# EAGLE design MicroLab (EAGLE 8.7.1)
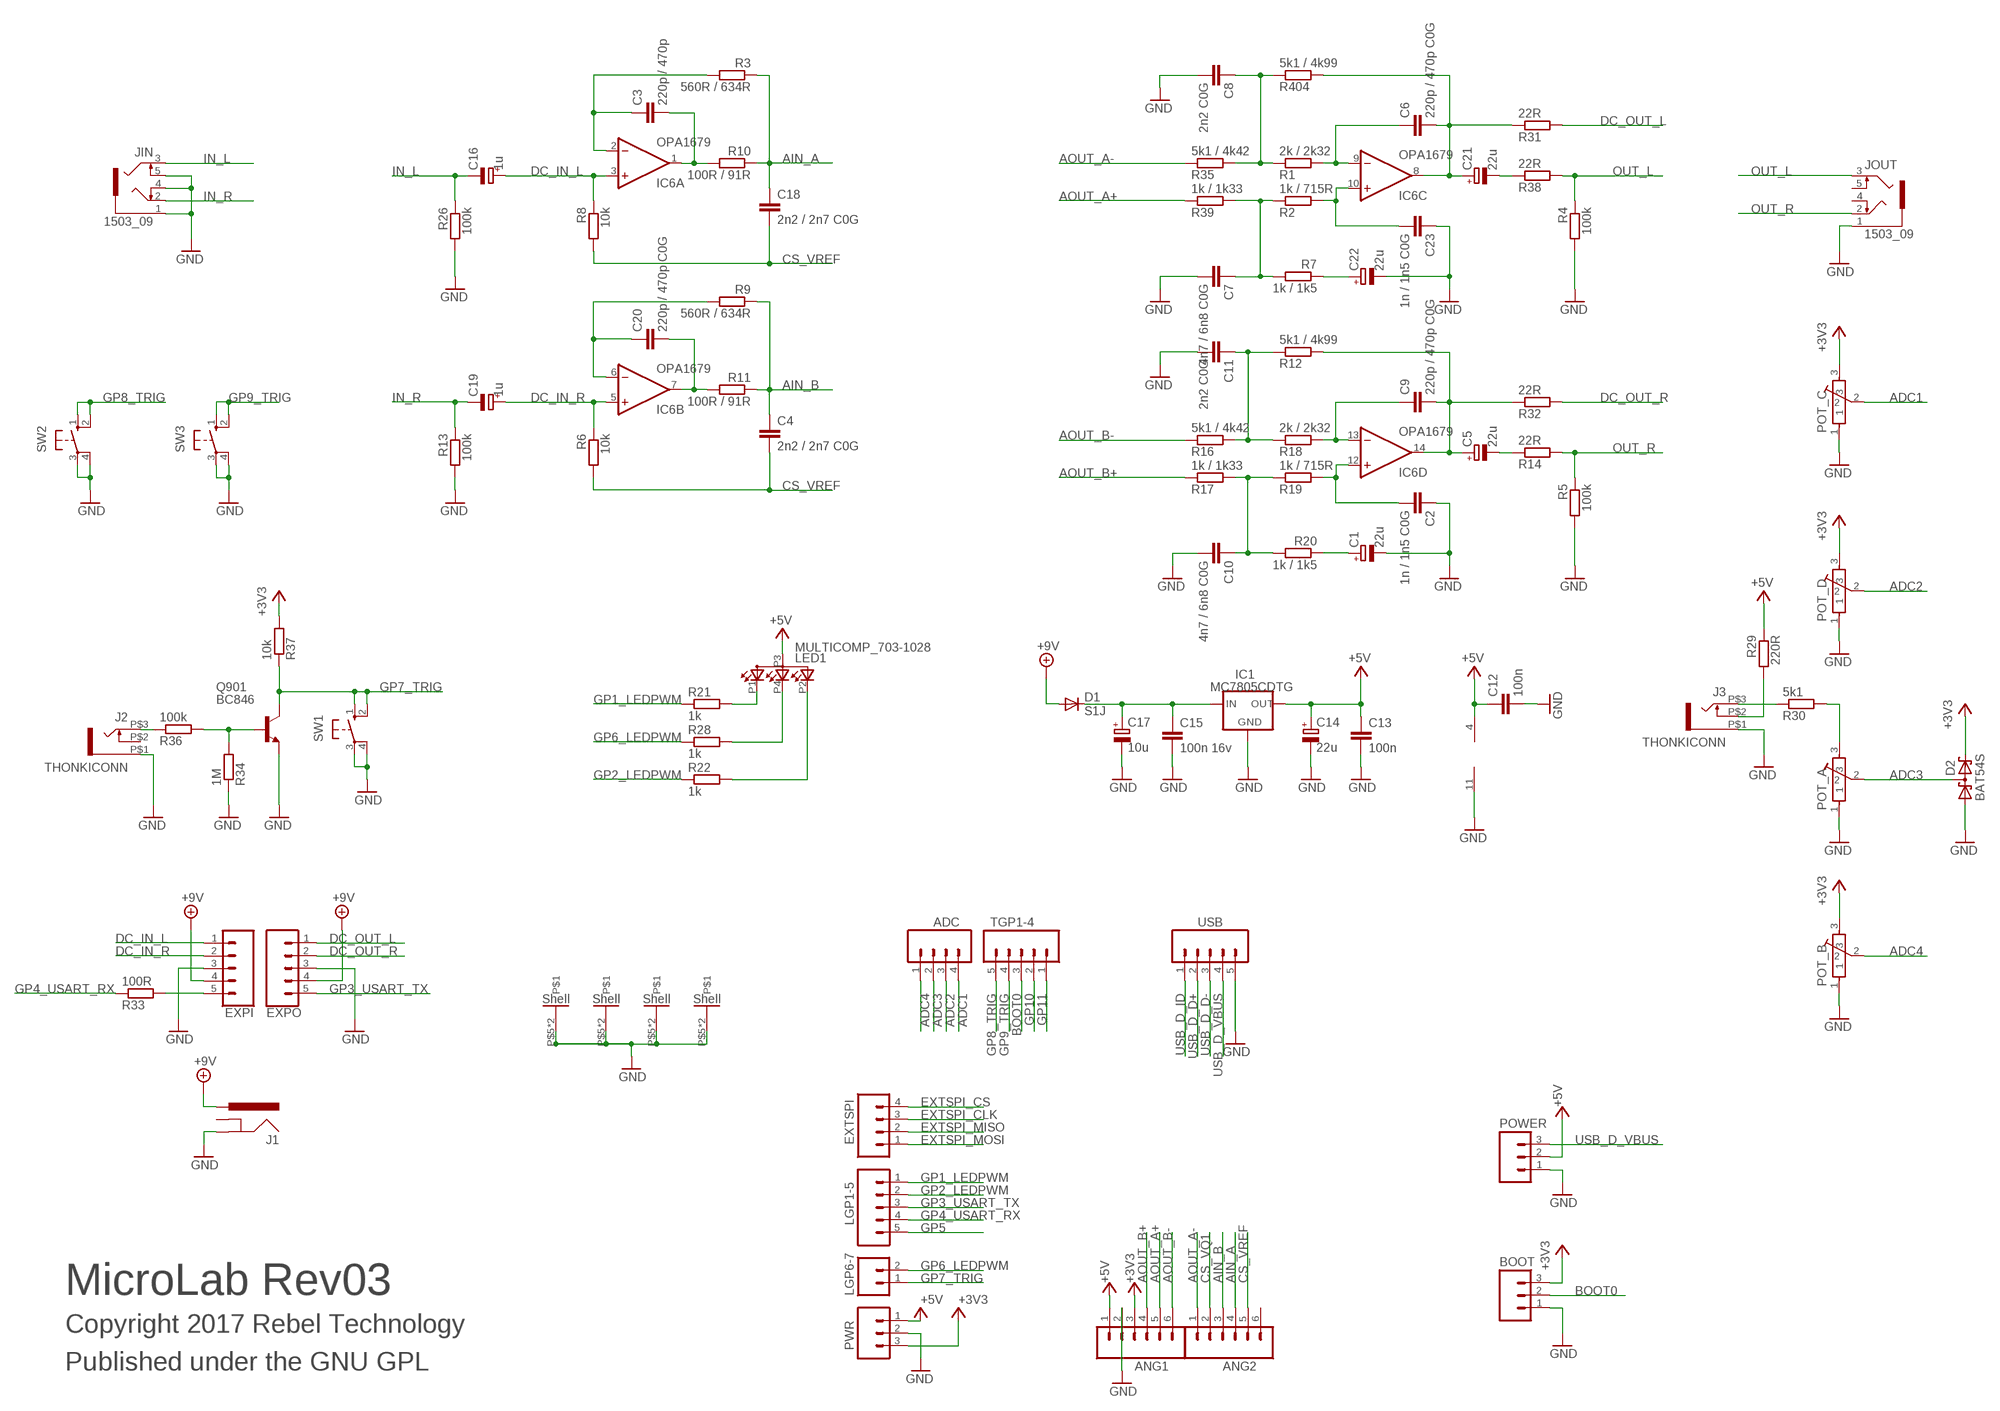
[diagram p0: schematic, sheet 1]

## Parts
ADC  M04PTH  [1X04]
ANG1  M06SIP  [1X06]
ANG2  M06SIP  [1X06]
BOOT  M03PTH  [1X03]
C1  22u  CPOL-EU153CLV-0505  [CPOL-5]
C2  1n / 1n5 C0G  C-EUC0603  [C0603]
C3  220p / 470p  C-EUC0603  [C0603]
C4  2n2 / 2n7 C0G  C-EUC0603  [C0603]
C5  22u  CPOL-EU153CLV-0505  [CPOL-5]
C6  220p / 470p C0G  C-EUC0603  [C0603]
C7  4n7 / 6n8 C0G  C-EUC0603  [C0603]
C8  2n2 C0G  C-EUC0603  [C0603]
C9  220p / 470p C0G  C-EUC0603  [C0603]
C10  4n7 / 6n8 C0G  C-EUC0603  [C0603]
C11  2n2 C0G  C-EUC0603  [C0603]
C12  100n  C-EUC0603  [C0603]
C13  100n  C-EUC0603  [C0603]
C14  22u  CPOL-EU153CLV-0505  [CPOL-5]
C15  100n 16v  C-EUC0603  [C0603]
C16  1u  CPOL-EU153CLV-0405  [153CLV-0405]
C17  10u  CPOL-EU153CLV-0405  [153CLV-0405]
C18  2n2 / 2n7 C0G  C-EUC0603  [C0603]
C19  1u  CPOL-EU153CLV-0405  [153CLV-0405]
C20  220p / 470p C0G  C-EUC0603  [C0603]
C21  22u  CPOL-EU153CLV-0505  [CPOL-5]
C22  22u  CPOL-EU153CLV-0505  [CPOL-5]
C23  1n / 1n5 C0G  C-EUC0603  [C0603]
D1  S1J  DIODESMA  [SMA-DIODE]
D2  BAT54S  [SOT23]
EXPI  CONN_05JST-VERT  [JST-5-PTH-VERT]
EXPO  CONN_05JST-VERT  [JST-5-PTH-VERT]
EXTSPI  M04PTH  [1X04]
IC1  MC7805CDTG  MC78XX  [DPACK]
IC6  OPA1679  LM324D  [SO14]
J1  POWER_JACKPTH  [POWER_JACK_PTH]
J2  THONKICONN  [THONKICONN]
J3  THONKICONN  [THONKICONN]
JIN  1503_09  [1503_09]
JOUT  1503_09  [1503_09]
LED1  MULTICOMP_703-1028  [RGB-LED-703-1028]
LGP1-5  M05PTH  [1X05]
LGP6-7  M02PTH  [1X02]
POT_A  POT-ALPS-RK09L1140  [POT-ALPS-RK09L1140]
POT_B  POT-ALPS-RK09L1140  [POT-ALPS-RK09L1140]
POT_C  POT-ALPS-RK09L1140  [POT-ALPS-RK09L1140]
POT_D  POT-ALPS-RK09L1140  [POT-ALPS-RK09L1140]
POWER  M03PTH  [1X03]
PWR  M03PTH  [1X03]
Q901  BC846  [SOT23]
R1  2k / 2k32  R-EU_0603  [0603]
R2  1k / 715R  R-EU_0603  [0603]
R3  560R / 634R  R-EU_0603  [0603]
R4  100k  R-EU_0603  [0603]
R5  100k  R-EU_0603  [0603]
R6  10k  R-EU_0603  [0603]
R7  1k / 1k5  R-EU_0603  [0603]
R8  10k  R-EU_0603  [0603]
R9  560R / 634R  R-EU_0603  [0603]
R10  100R / 91R  R-EU_0603  [0603]
R11  100R / 91R  R-EU_0603  [0603]
R12  5k1 / 4k99  R-EU_0603  [0603]
R13  100k  R-EU_0603  [0603]
R14  22R  R-EU_0603  [0603]
R16  5k1 / 4k42  R-EU_0603  [0603]
R17  1k / 1k33  R-EU_0603  [0603]
R18  2k / 2k32  R-EU_0603  [0603]
R19  1k / 715R  R-EU_0603  [0603]
R20  1k / 1k5  R-EU_0603  [0603]
R21  1k  R-EU_0603  [0603]
R22  1k  R-EU_0603  [0603]
R26  100k  R-EU_0603  [0603]
R28  1k  R-EU_0603  [0603]
R29  220R  R-EU_0603  [0603]
R30  5k1  R-EU_0603  [0603]
R31  22R  R-EU_0603  [0603]
R32  22R  R-EU_0603  [0603]
R33  100R  R-EU_0603  [0603]
R34  1M  R-EU_0603  [0603]
R35  5k1 / 4k42  R-EU_0603  [0603]
R36  100k  R-EU_0603  [0603]
R37  10k  R-EU_0603  [0603]
R38  22R  R-EU_0603  [0603]
R39  1k / 1k33  R-EU_0603  [0603]
R404  5k1 / 4k99  R-EU_0603  [0603]
SW1  10-XX  [B3F-10XX]
SW2  10-XX  [B3F-10XX]
SW3  10-XX  [B3F-10XX]
TGP1-4  M05PTH  [1X05]
USB  M05PTH  [1X05]

## Nets
+3V3: ANG1.3 BOOT.3 D2.2(C2) POT_B.3 POT_C.3 POT_D.3 PWR.3 R37.2
+5V: ANG1.1 C12.1 C13.1 C14.+ IC1.3(OUT) IC6.4(P:V+) LED1.P3(A) POWER.2 PWR.1 R29.1
+9V: D1.A EXPI.4 EXPO.4 J1.PWR
ADC1: ADC.4 POT_C.2
ADC2: ADC.3 POT_D.2
ADC3: ADC.2 D2.3(C1A2) POT_A.2
ADC4: ADC.1 POT_B.2
AIN_A: ANG2.4 C18.1 R3.1 R10.1
AIN_B: ANG2.3 C4.1 R9.1 R11.1
AOUT_A+: ANG1.5 R39.1
AOUT_A-: ANG2.1 R35.1
AOUT_B+: ANG1.4 R17.1
AOUT_B-: ANG1.6 R16.1
BOOT0: BOOT.2 TGP1-4.3
CS_VQ1: ANG2.2
CS_VREF: ANG2.5 C4.2 C18.2 R6.2 R8.2
DC_IN_L: C16.+ EXPI.1 IC6.3(A:+IN) R8.1
DC_IN_R: C19.+ EXPI.2 IC6.5(B:+IN) R6.1
DC_OUT_L: EXPO.1 R31.2
DC_OUT_R: EXPO.2 R32.2
EXTSPI_CLK: EXTSPI.3
EXTSPI_CS: EXTSPI.4
EXTSPI_MISO: EXTSPI.2
EXTSPI_MOSI: EXTSPI.1
GND: ANG1.2 BOOT.1 C1.- C2.1 C7.2 C8.2 C10.2 C11.2 C12.2 C13.2 C14.- C15.2 C17.- C22.- C23.1 D2.1(A1) EXPI.3 EXPO.3 IC1.4(GND) IC6.11(P:V-) J1.GND J2.P$1 J3.P$1 JIN.1 JIN.4 JIN.5 JOUT.1 POT_A.1 POT_A.P$5 POT_A.P$6 POT_B.1 POT_B.P$5 POT_B.P$6 POT_C.1 POT_C.P$5 POT_C.P$6 POT_D.1 POT_D.P$5 POT_D.P$6 POWER.1 PWR.2 Q901.2(E) R4.2 R5.2 R13.2 R26.2 R34.1 SW1.3(P) SW1.4(P1) SW2.3(P) SW2.4(P1) SW3.3(P) SW3.4(P1) USB.5
GP1_LEDPWM: LGP1-5.1 R21.1
GP2_LEDPWM: LGP1-5.2 R22.1
GP3_USART_TX: EXPO.5 LGP1-5.3
GP4_USART_RX: LGP1-5.4 R33.1
GP5: LGP1-5.5
GP6_LEDPWM: LGP6-7.2 R28.1
GP7_TRIG: LGP6-7.1 Q901.3(C) R37.1 SW1.1(S) SW1.2(S1)
GP8_TRIG: SW2.1(S) SW2.2(S1) TGP1-4.5
GP9_TRIG: SW3.1(S) SW3.2(S1) TGP1-4.4
GP10: TGP1-4.2
GP11: TGP1-4.1
IN_L: C16.- JIN.3 R26.1
IN_R: C19.- JIN.2 R13.1
N$1: EXPI.5 R33.2
N$3: C3.1 IC6.2(A:-IN) R3.2
N$4: C20.2 IC6.7(B:OUT) R11.2
N$5: C20.1 IC6.6(B:-IN) R9.2
N$6: C3.2 IC6.1(A:OUT) R10.2
N$7: C6.1 IC6.9(C:-IN) R1.2
N$8: C1.+ R20.1
N$9: C21.- R38.1
N$10: C22.+ R7.1
N$11: C23.2 IC6.10(C:+IN) R2.2
N$12: C5.+ C9.2 IC6.14(D:OUT) R12.2 R32.1
N$13: C5.- R14.1
N$15: C7.1 R2.1 R7.2 R39.2
N$16: LED1.P1(CRED) R21.2
N$17: LED1.P2(CGREEN) R22.2
N$19: LED1.P4(CBLUE) R28.2
N$22: J2.P$3 R36.1
N$23: J3.P$2 R29.2
N$24: C11.1 R12.1 R16.2 R18.1
N$25: POT_A.3 R30.2
N$26: C9.1 IC6.13(D:-IN) R18.2
N$27: J3.P$3 R30.1
N$29: C15.1 C17.+ D1.C IC1.1(IN)
N$30: C2.2 IC6.12(D:+IN) R19.2
N$32: C10.1 R17.2 R19.1 R20.2
N$37: Q901.1(B) R34.2 R36.2
N$39: C6.2 C21.+ IC6.8(C:OUT) R31.1 R404.2
N$41: C8.1 R1.1 R35.2 R404.1
OUT_L: JOUT.3 R4.1 R38.2
OUT_R: JOUT.2 R5.1 R14.2
USB_D_D+: USB.2
USB_D_D-: USB.3
USB_D_ID: USB.1
USB_D_VBUS: POWER.3 USB.4
Unconnected: ANG2.6 J1.GNDBREAK J2.P$2 JOUT.4 JOUT.5

## Notes on the sheet
- MicroLab Rev03
- Copyright 2017 Rebel Technology
- Published under the GNU GPL

## Library data of the parts
ADC EXTSPI = SparkFun:M04: Header 4 Standard 4-pin 0.1" header. Use with straight break away headers (SKU : PRT-00116), right angle break away headers (PRT-00553), swiss pins (PRT-00743), machine pins (PRT-00117), and female headers (PRT-00115). Molex polarized connector foot print use with SKU : PRT-08231 with associated crimp pins and housings. 1MM SMD Version SKU: PRT-10208
ANG1 ANG2 = SparkFun:M06: Header 6 Standard 6-pin 0.1" header. Use with straight break away headers (SKU : PRT-00116), right angle break away headers (PRT-00553), swiss pins (PRT-00743), machine pins (PRT-00117), and female headers (PRT-00115). Molex polarized connector foot print use with SKU : PRT-08094 with associated crimp pins and housings. NOTES ON THE VARIANTS LOCK and LOCK_LONGPADS... This footprint was designed to help hold the alignment of a through-hole component (i.e. 6-pin header) while soldering it into place. You may notice that each hole has been shifted either up or down by 0.005 of an inch from it's more standard position (which is a perfectly straight line). This slight alteration caused the pins (the squares in the middle) to touch the edges of the holes. Because they are alternating, it causes a "brace" to hold the component in place. 0.005 has proven to be the perfect amount of "off-center" position when using our standard breakaway headers. Although looks a little odd when you look at the bare footprint, once you have a header in there, the alteration is very hard to notice. Also, if you push a header all the way into place, it is covered up entirely on the bottom side. This idea of altering the position of holes to aid alignment will be further integrated into the Sparkfun Library for other footprints. It can help hold any component with 3 or more connection pins.
BOOT POWER PWR = SparkFun:M03: Header 3 Standard 3-pin 0.1" header. Use with straight break away headers (SKU : PRT-00116), right angle break away headers (PRT-00553), swiss pins (PRT-00743), machine pins (PRT-00117), and female headers (PRT-00115). Molex polarized connector foot print use with SKU : PRT-08232 with associated crimp pins and housings.
C1 C5 C14 C16 C17 C19 C21 C22 = Rebel:CPOL-EU: POLARIZED CAPACITOR, European symbol
C2-C4 C6-C12 C18 C20 C23 = resistor:C-EU: CAPACITOR, European symbol
C13 C15 = Rebel:C-EU: CAPACITOR, European symbol
D1 = SparkFun:DIODE: Diode These are standard reverse protection diodes and small signal diodes. SMA package can handle up to about 1A. SOD-323 can handle about 200mA. What the SOD-323 package when ordering, there are some mfgs out there that are 5-pin packages.
D2 = diode:BAT54S: Schottky Diodes Pin connection corrected 2011-05-04 Source: Fairchild .. BAT54.pdf
EXPI EXPO = SparkFun-Connectors:CONN_05: Multi connection point. Often used as Generic Header-pin footprint for 0.1 inch spaced/style header connections On any of the 0.1 inch spaced packages, you can populate with these: Break Away Headers - Straight <https://www.sparkfun.com/products/116> (PRT-00116) Break Away Male Headers - Right Angle <https://www.sparkfun.com/products/553> (PRT-00553) Female Headers <https://www.sparkfun.com/products/115> (PRT-00115) Break Away Headers - Machine Pin <https://www.sparkfun.com/products/117> (PRT-00117) Break Away Female Headers - Swiss Machine Pin <https://www.sparkfun.com/products/743> (PRT-00743) For SCREWTERMINALS and SPRING TERMINALS visit here: Screw Terimnals on SparkFun.com <https://www.sparkfun.com/search/results?term=Screw+Terminals> (5mm/3.5mm/2.54mm spacing) This device is also useful as a general connection point to wire up your design to another part of your project. Our various solder wires solder well into these plated through hole pads. Hook-Up Wire - Assortment (Stranded, 22 AWG) <https://www.sparkfun.com/products/11375> (PRT-11375) Hook-Up Wire - Assortment (Solid Core, 22 AWG) <https://www.sparkfun.com/products/11367> (PRT-11367) View the entire wire category on our website here <https://www.sparkfun.com/categories/141> Special notes: Molex polarized connector foot print use with SKU : PRT-08231 with associated crimp pins and housings. 1MM SMD Version SKU: PRT-10208
IC1 = James:MC78XX: VOLTAGE REGULATOR; OC_FARNELL: 2296028
IC6 = linear:LM324: OP AMP
J1 = SparkFun:POWER_JACK: Power Jack This is the standard 5.5mm barrel jack for power. The PTH is the most common, proven, reliable, footprint. All others are experimental. The Slot footprint only works if the mill layer is transmitted to the PCB fab house so be warned. Spark Fun Electronics SKU : PRT-00119. Mating wall wart : TOL-00298 (and others)
J2 J3 = Rebel:THONKICONN
JIN JOUT = con-lumberg:1503_09: Jack connectors according to JISC 6560, 3.5 mm Klinkeneinbaukupplung nach JISC 6560, 3,5 mm, 3-polig/ stereo, abgewinkelte Ausführung, mit 2 Öffnern und Lötaugen, für Leiterplatten Rückseitenmontage Source: http://www.lumberg.com/Produkte/PDFs/1503_09.pdf; OC_FARNELL: 1243244; OC_NEWARK: unknown
LED1 = Rebel:MULTICOMP_703-1028: Farnell: 2112143
LGP1-5 TGP1-4 USB = SparkFun:M05: Header 5 Standard 5-pin 0.1" header. Use with straight break away headers (SKU : PRT-00116), right angle break away headers (PRT-00553), swiss pins (PRT-00743), machine pins (PRT-00117), and female headers (PRT-00115). Molex polarized connector foot print use with SKU : PRT-08230 with associated crimp pins and housings.
LGP6-7 = SparkFun:M02: Header 2 Standard 2-pin 0.1" header. Use with straight break away headers (SKU : PRT-00116), right angle break away headers (PRT-00553), swiss pins (PRT-00743), machine pins (PRT-00117), and female headers (PRT-00115). Molex polarized connector foot print use with SKU : PRT-08233 with associated crimp pins and housings.
POT_A POT_B POT_C POT_D = Rebel:POT-ALPS-RK09L
Q901 = transistor:BC846: NPN TRANSISTOR
R1-R14 R16-R22 R26 R28-R39 R404 = Rebel:R-EU_: RESISTOR, European symbol
SW1-SW3 = switch-omron:10-XX: OMRON SWITCH; MPN: B3F-1000; OC_FARNELL: 176432; OC_NEWARK: 36M3542

## Net classes
1 power: width 0.178 mm, drill 0.305 mm, clearance 0.178 mm to class 0, clearance 0.178 mm

## Board
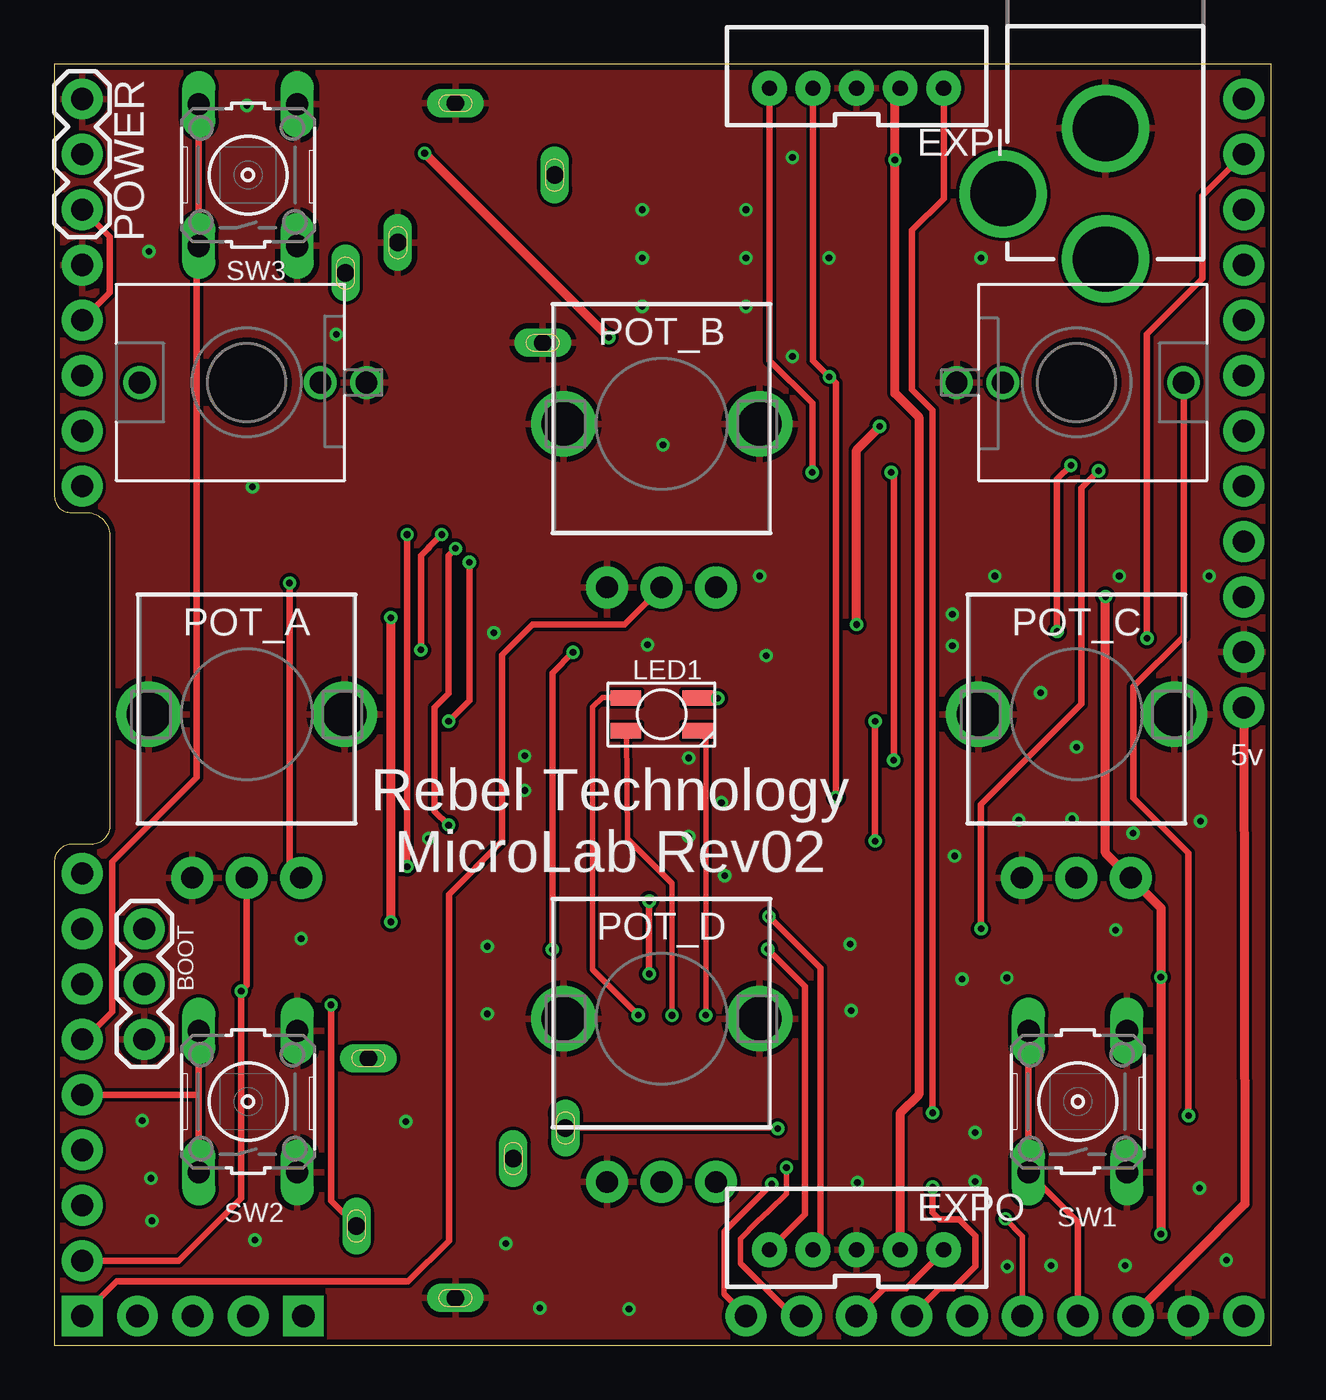
[diagram p1: board, top side]
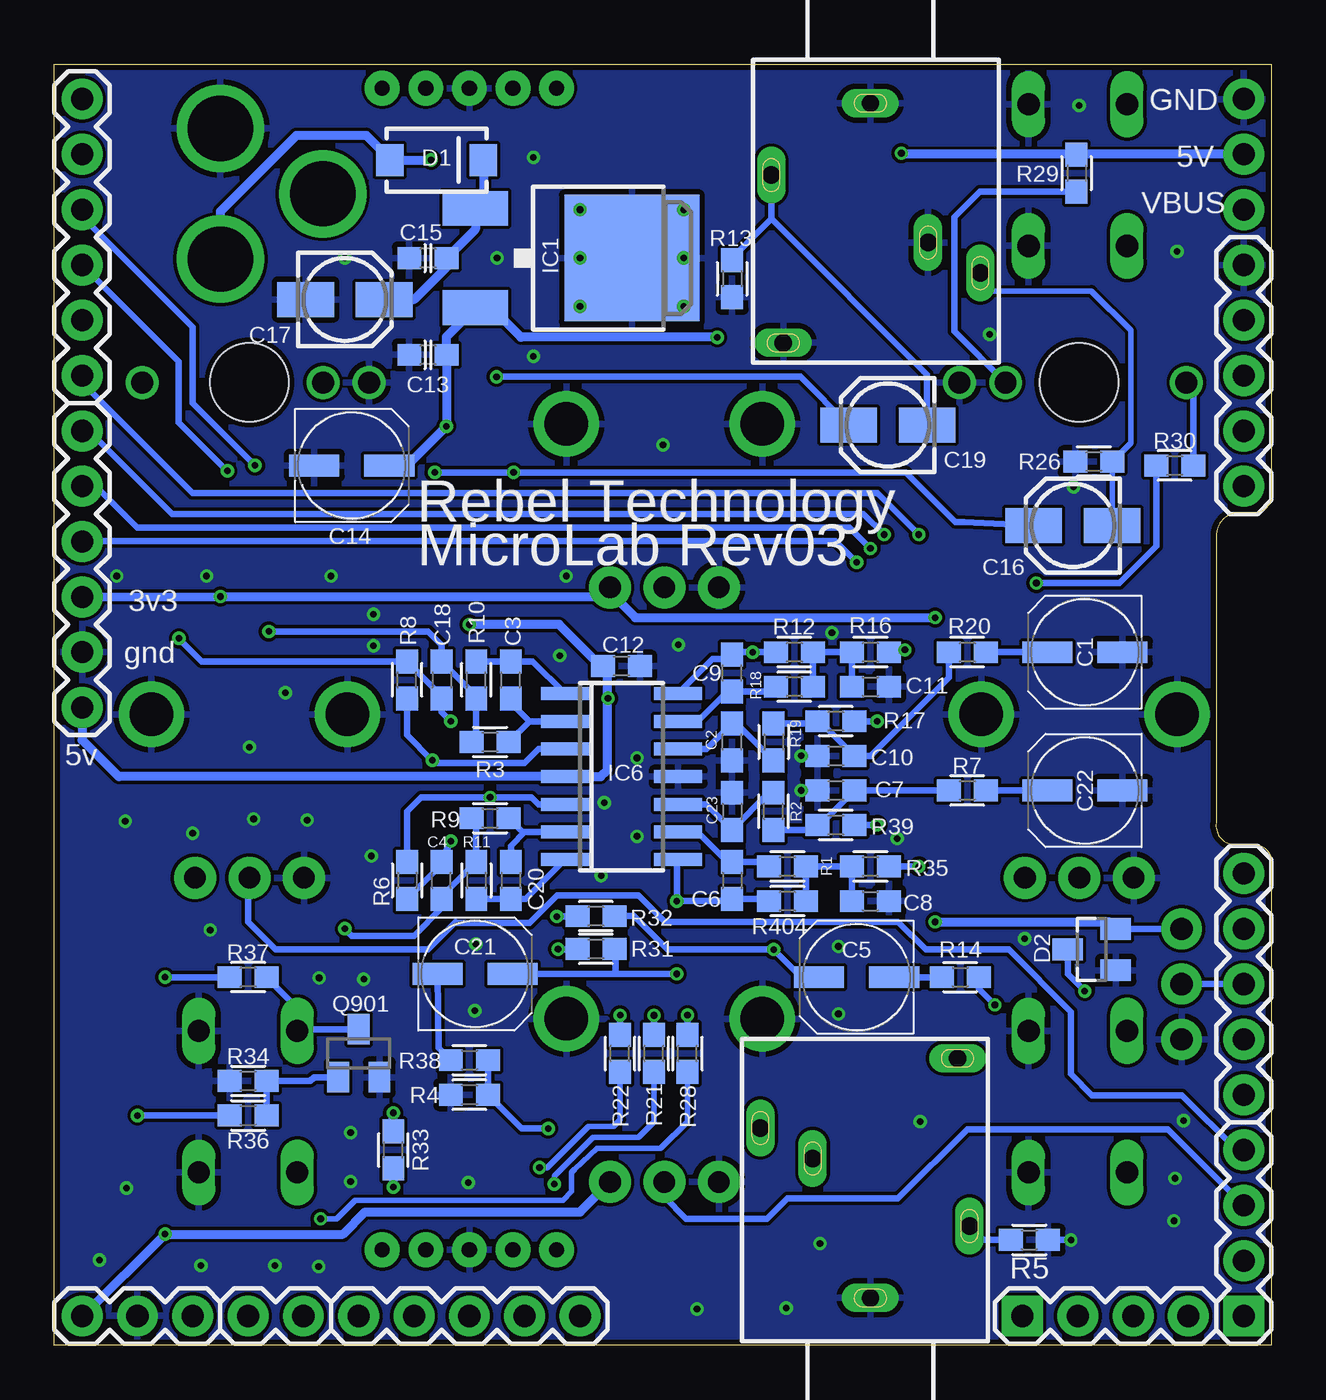
[diagram p2: board, bottom side, seen from below]

Size 55.88 x 58.8 mm. Coordinates in mm from the lower left corner, seen from the top.
Outline: 55.88,58.8 0,58.8 0,38.97 arc90 0.76,38.23 1.52,38.23 arc-90 2.54,37.06 2.54,23.97 arc-90 1.78,22.99 0.76,22.99 arc90 0,22.16 0,0 55.88,0 55.88,58.8
Copper layers (1*16): Top 0.035mm / dielectric 1.5mm / Bottom 0.035mm
Design rules "SeeedStudio_2layer_DRU_no_angle_20140221": minimum track width 6mil, minimum drill 12mil, track to track 6mil, track to pad 6mil, pad to pad 6mil, via to via 6mil, smd to smd 0mil, copper to edge 10mil, drill to drill 10mil, minimum pad ring 10mil, minimum via ring 6mil, stop-mask expansion 2mil, vias tented up to drill 100mil, thermal gap 10mil

### Footprints (pad centres in the part's own frame; a part is rotated, then mirrored left to right if it is on the bottom)
1X04 = drill 1.016 pad 1.88 square: 1 0,0 | drill 1.016 pad 1.88: 2 2.54,0; 3 5.08,0; 4 7.62,0
1X06 = drill 1.016 pad 1.88: 1 0,0; 2 2.54,0; 3 5.08,0; 4 7.62,0; 5 10.16,0; 6 12.7,0
1X03 = drill 1.016 pad 1.88: 1 0,0; 2 2.54,0; 3 5.08,0
CPOL-5 = smd 2.3 x 1: + 1.725,0; - -1.725,0
C0603 = smd 1.1 x 1: 1 -0.85,0; 2 0.85,0
153CLV-0405 = smd 2.6 x 1.6: + 1.8,0; - -1.8,0
SMA-DIODE = smd 1.27 x 1.47: A -2.15,0; C 2.15,0
SOT23 = smd 1 x 1.4: 1 -0.95,-1.1; 2 0.95,-1.1; 3 0,1.1
JST-5-PTH-VERT = drill 0.7 pad 1.6: 1 -4,0.18; 2 -2,0.18; 3 0,0.18; 4 2,0.18; 5 4,0.18
DPACK = smd 1.6 x 3: 1 -2.28,-4.8; 3 2.28,-4.8 | smd 5.8 x 6.2: 4 0,2.38
SO14 = smd 0.6 x 2.2: 1 -3.81,-2.6; 2 -2.54,-2.6; 3 -1.27,-2.6; 4 0,-2.6; 5 1.27,-2.6; 6 2.54,-2.6; 7 3.81,-2.6; 8 3.81,2.6; 9 2.54,2.6; 10 1.27,2.6; 11 0,2.6; 12 -1.27,2.6; 13 -2.54,2.6; 14 -3.81,2.6
POWER_JACK_PTH = drill 2.997: GND 0,7.7; GNDBREAK 4.7,10.7; PWR 0,13.7
THONKICONN = drill 1: P$1 0,-5.5; P$2 0,-3.38; P$3 0,4.92 | hole 3.6: 0,0
1503_09 = drill 0.8 pad 1.2 long: 1 0,-2.1; 2 -4.55,-5.4; 3 5.05,-9.9; 4 -4,-13.1; 5 2.65,-8.5
RGB-LED-703-1028 = smd 0.7 x 1.4: P1 -0.75,1.65; P2 -0.75,-1.65; P3 0.75,-1.65; P4 0.75,1.65
1X05 = drill 1.016 pad 1.88: 1 0,0; 2 2.54,0; 3 5.08,0; 4 7.62,0; 5 10.16,0
1X02 = drill 1.016 pad 1.88: 1 0,0; 2 2.54,0
POT-ALPS-RK09L1140 = drill 1 pad 1.93: 1 -2.5,-7.5; 2 0,-7.5; 3 2.5,-7.5 | drill 2: P$5 -4.5,0; P$6 4.5,0
0603 = smd 1.1 x 1: 1 -0.85,0; 2 0.85,0
B3F-10XX = drill 1.016 long: 1 -3.251,2.261; 2 3.251,2.261; 3 -3.251,-2.261; 4 3.251,-2.261

### Placement (x,y rotation side)
ADC  1.27,1.33 90 bottom
ANG1  54.61,29.27 90 bottom
ANG2  54.61,44.51 90 bottom
BOOT  4.13,14.03 90 top
C1  8.57,31.81 180 bottom
C2  24.77,27.69 90 bottom
C3  34.93,30.54 90 bottom
C4  38.1,21.34 90 bottom
C5  19.05,16.89 180 bottom
C6  24.77,21.34 270 bottom
C7  20,25.46 180 bottom
C8  18.41,20.38 0 bottom
C9  24.77,30.86 90 bottom
C10  20,27.05 180 bottom
C11  18.41,30.23 0 bottom
C12  29.84,31.18 0 bottom
C13  38.73,45.47 180 bottom
C14  42.23,40.39 0 bottom
C15  38.73,49.91 180 bottom
C16  9.11,37.63 180 bottom
C17  42.55,48.01 0 bottom
C18  38.1,30.54 270 bottom
C19  17.62,42.24 180 bottom
C20  34.93,21.34 270 bottom
C21  36.56,17.04 0 bottom
C22  8.57,25.46 180 bottom
C23  24.77,24.51 270 bottom
D1  38.34,54.41 0 bottom
D2  8.25,18.16 90 bottom
EXPI  36.83,57.53 0 top
EXPO  36.83,4.19 0 top
EXTSPI  11.43,1.33 0 bottom
IC1  31.75,49.91 270 bottom
IC6  29.84,26.1 270 bottom
J1  48.26,63.56 180 top
J2  46.93,44.2 270 top
J3  8.83,44.2 90 top
JIN  18.41,59.12 0 bottom
JOUT  18.41,0.06 180 bottom
LED1  27.88,28.96 90 top
LGP1-5  31.75,1.33 180 bottom
LGP6-7  46.99,1.33 0 bottom
POT_A  8.83,28.96 0 top
POT_B  27.88,42.29 0 top
POT_C  46.93,28.96 0 top
POT_D  27.88,14.99 0 top
POWER  1.27,57.21 270 top
PWR  49.53,1.33 180 bottom
Q901  41.91,13.4 0 bottom
R1  22.23,21.97 180 bottom
R2  22.86,24.51 90 bottom
R3  35.88,27.69 0 bottom
R4  36.83,11.49 180 bottom
R5  11.11,4.83 0 bottom
R6  39.69,21.34 270 bottom
R7  13.97,25.46 180 bottom
R8  39.69,30.54 90 bottom
R9  35.88,24.19 0 bottom
R10  36.51,30.54 90 bottom
R11  36.51,21.34 270 bottom
R12  21.91,31.81 180 bottom
R13  24.77,48.96 270 bottom
R14  14.29,16.89 0 bottom
R16  18.41,31.81 180 bottom
R17  20,28.64 180 bottom
R18  21.91,30.23 180 bottom
R19  22.86,27.69 270 bottom
R20  13.97,31.81 180 bottom
R21  28.35,13.39 90 bottom
R22  29.91,13.39 90 bottom
R26  8.16,40.57 180 bottom
R28  26.81,13.39 90 bottom
R29  8.95,53.81 270 bottom
R30  4.45,40.39 180 bottom
R31  31.02,18.19 180 bottom
R32  31.02,19.69 180 bottom
R33  40.32,8.95 90 bottom
R34  46.99,12.13 0 bottom
R35  18.41,21.97 180 bottom
R36  46.99,10.54 0 bottom
R37  46.99,16.89 180 bottom
R38  36.83,13.08 0 bottom
R39  20,23.88 180 bottom
R404  22.23,20.38 180 bottom
SW1  46.99,11.18 90 top
SW2  8.89,11.18 90 top
SW3  8.89,53.72 90 top
TGP1-4  1.27,21.65 270 bottom
USB  1.27,39.43 90 bottom

### Tracks (layer width: path | path; a pad name or v marks a point on that pad's centre or on a via)
+3V3  (via drill 0.3)
  Top 0.406: v48.26,34.37 48.26,22.61 49.41,21.46 POT_C.3 49.43,21.44 50.8,20.07 v50.8,16.89 v50.8,5.1 | v15.44,33.4 v15.44,19.43
  Bottom 0.305: BOOT.3 D2.2 | R37.2 v50.8,16.89
  Bottom 0.406: ANG1.3 v48.26,34.37 30.8,34.37 POT_B.3 30.38,34.57 29.21,33.4 v15.44,33.4 | v15.44,19.43 7.48,19.43 D2.2 | PWR.3 54.56,1.33 v50.8,5.1 42.63,5.1 41.61,6.12 31.75,6.12 POT_D.3
+5V  (via drill 0.3)
  Top 0.406: v16.99,54.72 v25.45,46.27 | PWR.1 52.07,3.87 52.12,3.94 54.66,6.48 ANG1.1 | v30.46,29.69 LED1.P3 | v36.83,33.08 36.83,41.08 37.88,42.14 v37.88,42.19
  Bottom 0.305: 16.94,54.67 v16.99,54.72 | R29.1 8.94,54.67 1.96,54.67
  Bottom 0.406: 30.48,29.69 30.48,26.42 30.8,26.1 IC6.4 52.93,26.1 54.61,27.78 ANG1.1 | 30.48,29.69 30.48,30.96 C12.1 30.8,31.18 32.7,33.08 v36.83,33.08 | v25.45,46.27 34.46,46.27 36.18,48.01 IC1.3 37.88,46.3 C13.1 v37.88,42.19 39.69,40.39 C14.+ | v30.46,29.69 30.48,29.69 | POWER.2 1.96,54.67 16.94,54.67
+9V  (via drill 0.3)
  Top 0.406: EXPO.4 38.83,10.64 39.69,11.49 39.69,42.61 38.59,43.71 v38.59,54.42 38.59,57.47 EXPI.4
  Bottom 0.406: J1.PWR 48.26,52.04 44.76,55.54 41.56,55.54 40.38,54.37 D1.A 38.6,54.41 v38.59,54.42
ADC1
  Bottom 0.305: POT_C.2 46.99,21.39 46.99,19.43 45.72,18.16 38.73,18.16 37.47,19.43 37.43,19.39 34.06,19.39 32.81,20.64 29.06,20.64 27.85,19.43 17.14,19.43 15.88,18.16 12.07,18.16 9.21,15.3 9.21,12.45 8.24,11.48 4.11,11.48 1.59,8.95 ADC.4
ADC2
  Bottom 0.305: ADC.3 4.76,9.91 13.97,9.91 17.14,6.73 22.23,6.73 23.16,5.79 26.88,5.79 27.88,6.79 POT_D.2
ADC3  (via drill 0.3)
  Top 0.305: 1.22,3.87 ADC.2 5.72,3.87 8.57,6.73 v8.57,16.26 8.83,16.51 POT_A.2
  Bottom 0.305: D2.3 9.36,17.04 v8.57,16.26
ADC4
  Top 0.305: ADC.1 2.86,2.92 16.24,2.92 18.11,4.79 18.11,20.69 20.56,23.14 20.56,31.69 21.96,33.09 26.18,33.09 POT_B.2
AIN_A  (via drill 0.3)
  Top 0.305: v46.04,32.77 46.04,39.75 v46.67,40.39
  Bottom 0.305: R3.1 36.51,27.9 R10.1 36.51,29.81 C18.1 38.1,32.13 38.73,32.77 v46.04,32.77 | v46.67,40.39 49.53,43.24 49.53,46.74 54.61,51.82 ANG2.4
AIN_B  (via drill 0.3)
  Top 0.305: v42.55,19.11 42.55,24.83 47.16,29.44 47.16,39.35 v47.94,40.14
  Bottom 0.305: R11.1 36.51,22.07 | R11.1 36.51,23.98 R9.1 | v42.55,19.11 42.23,18.8 39.37,18.8 38.1,20.07 C4.1 38.1,20.6 R11.1 | v47.94,40.14 50.16,42.36 50.16,45.15 ANG2.3
AOUT_A+  (via drill 0.3)
  Top 0.305: v18.41,36.58 18.1,36.26 18.1,29.91 17.46,29.27 17.46,24.51 v18.1,23.88
  Bottom 0.305: R39.1 v18.1,23.88 | v18.41,36.58 19.38,37.54 52.07,37.53 53.98,39.43 ANG1.5
AOUT_A-  (via drill 0.3)
  Top 0.305: v16.19,37.21 v16.19,21.97
  Bottom 0.305: v16.19,37.21 18.1,39.12 49.53,39.12 54.61,44.2 ANG2.1 | v16.19,21.97 R35.1
AOUT_B+  (via drill 0.3)
  Top 0.305: v19.05,35.94 19.05,29.59 v18.1,28.64
  Bottom 0.305: R17.1 v18.1,28.64 | v19.05,35.94 20.02,36.91 54.6,36.91 ANG1.4
AOUT_B-  (via drill 0.3)
  Top 0.305: v17.78,37.21 17.24,36.67 17.14,36.58 16.83,36.26 v16.83,31.92
  Bottom 0.305: v17.78,37.21 18.73,38.16 50.48,38.16 54.29,41.97 ANG1.6 | v16.83,31.92 R16.1
BOOT0
  Bottom 0.305: TGP1-4.3 BOOT.2
CS_VREF  (via drill 0.3)
  Top 0.305: v50.16,32.45 50.16,46.42 52.7,48.96 52.7,52.77 ANG2.5 | v37.68,23.14 v37.68,28.64
  Bottom 0.305: R6.2 38.1,22.07 C4.2 v37.68,23.14 | v50.16,32.45 49.11,31.39 R8.2 38.1,29.81 C18.2 38.1,29.06 v37.68,28.64
DC_IN_L  (via drill 0.3)
  Top 0.305: v38.42,40.07 38.54,39.95 v38.54,26.85 | EXPI.1 32.83,45.21 34.8,43.24 v34.8,40.07
  Bottom 0.305: IC6.3 33.66,27.37 34.29,26.73 38.42,26.73 v38.54,26.85 39.69,28 R8.1 | v38.42,40.07 v34.8,40.07 16.79,40.07 14.51,37.79 14.13,37.79 C16.+
DC_IN_R  (via drill 0.3)
  Top 0.305: EXPI.2 34.83,45.21 35.54,44.5 v35.58,44.46 35.88,44.16 v35.88,25.15
  Bottom 0.305: IC6.5 33.66,24.83 33.97,25.15 v35.88,25.15 39.05,25.15 39.69,24.51 R6.1 | C19.+ 21.64,44.46 v35.58,44.46
DC_OUT_L  (via drill 0.3)
  Top 0.305: v32.76,18.18 34.46,16.47 34.46,7.68 34.46,7.39 34.46,6 EXPO.1
  Bottom 0.305: v32.76,18.18 31.88,18.18 R31.2
DC_OUT_R  (via drill 0.3)
  Top 0.305: v32.81,19.68 35.16,17.33 35.16,7.68 35.16,7.19 35.16,4.7 EXPO.2
  Bottom 0.305: v32.81,19.68 31.89,19.68 R32.2
GND  (via drill 0.3)
  Bottom 0.305: C10.2 v21.59,27.05 | C7.2 v21.59,25.46 | R5.2 v9.21,4.83
  other vias: 26.99,49.91 31.75,49.91 26.99,52.13 31.75,52.13 31.75,47.69 26.99,47.69 35.56,49.91 42.55,49.91 32.38,35.31 43.18,35.31 48.9,35.31 53.02,35.31 27.94,41.34 53.81,3.9 49.16,3.65 45.76,3.65 8.84,56.91 12.94,46.41 32.68,31.66 27.23,32.16 29.13,26.96 29.13,23.36 30.63,24.91 30.78,21.56 17.18,23.26 36.53,18.41 36.58,15.36 19.88,18.31 19.88,15.21 20.18,32.71 41.23,33.56 41.23,32.11 46.93,27.46 45.28,29.96 52.63,24.06 44.28,24.11 41.33,22.46 48.73,19.06 43.73,16.86 41.68,16.81 42.28,9.76 42.28,7.51 43.75,3.61 4.43,7.66 4.48,5.71 4.03,10.31 11.33,18.66 16.13,10.26 22.28,1.71 33.88,54.53 46.73,24.16 49.53,23.51 52.58,7.21 26.38,1.66 20.73,4.66 4.34,50.21 9.09,39.41 36.87,7.46 33.88,45.39
  pour Bottom: -11.43,-2.79 -11.43,63.25 59.69,63.25 59.69,-2.79
  pour Top: -10.16,-4.06 -10.16,61.98 60.96,61.98 60.96,-4.06
GP1_LEDPWM  (via drill 0.3)
  Top 0.254: LGP1-5.1 30.73,2.35 30.73,5.19 v32.94,7.39
  Bottom 0.254: R21.1 28.35,10.25 29.06,9.54 31.16,9.54 32.93,7.77 v32.94,7.39
GP2_LEDPWM  (via drill 0.3)
  Top 0.254: v33.61,8.14 33.61,6.95 32.82,6.16 32.26,5.65 31.5,4.89 31.5,3.75 33.91,1.33 LGP1-5.2
  Bottom 0.254: v33.61,8.14 33.26,8.14 31.36,10.04 30.21,10.04 29.91,10.34 29.91,10.93 R22.1
GP3_USART_TX
  Top 0.305: EXPO.5 40.83,4.32 39.12,2.6 38.1,2.6 LGP1-5.3
GP4_USART_RX  (via drill 0.3)
  Top 0.305: 39.41,1.37 LGP1-5.4 40.64,2.6 41.27,2.6 42.29,3.62 42.29,5.02 41.53,5.78 40.64,5.78 40.32,6.1 v40.32,7.25
  Bottom 0.406: R33.1 v40.32,7.25
GP6_LEDPWM  (via drill 0.3)
  Top 0.254: LGP6-7.2 44.45,5 v43.66,5.79
  Bottom 0.254: v43.66,5.79 42.93,5.79 42.08,6.64 32.54,6.64 32.13,7.05 32.13,7.94 32,8.06 30.96,9.04 28.06,9.04 26.81,10.24 R28.1
GP7_TRIG
  Top 0.305: SW1.2 SW1.1 46.99,5.66 LGP6-7.1
  Bottom 0.305: R37.1 44.73,15.48 SW1.2 44.66,14.5 Q901.3
GP8_TRIG
  Top 0.305: SW2.2 6.63,11.54 | 6.63,11.54 SW2.1 | TGP1-4.5 6.58,11.49 6.63,11.54
GP9_TRIG
  Top 0.305: TGP1-4.4 1.4,14.03 2.66,15.29 2.66,22.19 6.53,26.06 6.53,50.37 SW3.1 SW3.2
IN_L
  Bottom 0.254: C16.- R26.1 6.46,41.42 6.46,46.59 8.27,48.4 13.36,48.4
  Bottom 0.305: 13.36,48.4 JIN.3
IN_R
  Bottom 0.305: JIN.2 22.96,51.71 | R13.1 24.77,49.91 22.96,51.71 | C19.- 15.82,44.56 22.96,51.71
N$1  (via drill 0.3)
  Top 0.305: v40.32,10.66 40.32,42.93 39.37,43.88 39.37,51.18 40.83,52.64 EXPI.5
  Bottom 0.406: R33.2 v40.32,10.66
N$3
  Bottom 0.305: IC6.2 34.08,28.64 | 34.08,28.64 R3.2 | C3.1 34.93,29.49 34.08,28.64
N$4
  Bottom 0.305: IC6.7 34.25,20.49 C20.2 R11.2
N$5
  Bottom 0.305: IC6.6 34.29,23.56 | 34.29,23.56 34.39,23.56 R9.2 | C20.1 34.93,22.92 34.29,23.56
N$6
  Bottom 0.305: IC6.1 33.93,31.39 C3.2 R10.2
N$7
  Bottom 0.305: R1.2 23.29,22.19 C6.1 24.98,21.97 24.98,22.19 26.35,23.56 IC6.9
N$8
  Bottom 0.305: R20.1 C1.+
N$9
  Bottom 0.305: C21.- 38.24,13.64 R38.1
N$10
  Bottom 0.305: C22.+ R7.1
N$11
  Bottom 0.305: R2.2 23.07,25.36 C23.2 25.93,24.83 IC6.10
N$12  (via drill 0.3)
  Top 0.305: v22.86,18.16 22.86,30.86 v23.81,31.81
  Bottom 0.305: 22.54,17.84 v22.86,18.16 | 22.86,31.92 R12.2 v23.81,31.81 24.66,31.81 C9.2 24.98,31.5 25.66,31.5 IC6.14 | C5.+ 21.59,16.89 v22.86,18.16 | v22.86,18.16 27.73,18.16 29.26,19.69 R32.1
N$13
  Bottom 0.305: C5.- R14.1
N$15
  Bottom 0.305: R2.1 21.07,23.66 R39.2 20.74,23.88 C7.1 R7.2
N$16  (via drill 0.3)
  Top 0.254: LED1.P1 26.26,28.17 26.31,23.24 28.35,21.2 v28.35,15.14
  Bottom 0.305: R21.2 v28.35,15.14 v28.36,15.14
N$17  (via drill 0.3)
  Top 0.254: v29.91,15.14 29.91,27.83 LED1.P2
  Bottom 0.305: R22.2 v29.91,15.14
N$19  (via drill 0.3)
  Top 0.254: v26.81,15.14 24.71,17.24 24.71,29.29 25.16,29.74 26.19,29.74 LED1.P4
  Bottom 0.305: R28.2 v26.81,15.14
N$22  (via drill 0.3)
  Top 0.305: J2.P$3 51.85,32.54 49.53,30.23 49.53,25.13 52.07,22.59 v52.07,10.54
  Bottom 0.305: v52.07,10.54 R36.1
N$23
  Bottom 0.305: 12.17,44.16 J3.P$2 14.56,46.55 14.56,51.79 13.39,52.96 R29.2
N$24
  Bottom 0.305: R18.1 R12.1 R16.2 C11.1
N$25  (via drill 0.3)
  Top 0.305: v10.8,34.99 10.8,21.99 POT_A.3
  Bottom 0.305: v10.8,34.99 6.99,34.99 5.29,36.68 R30.2
N$26
  Bottom 0.305: R18.2 22.97,30.01 C9.1 24.98,30.23 24.98,30.01 26.35,28.64 IC6.13
N$27
  Bottom 0.305: R30.1 3.59,43.88 J3.P$3
N$29
  Bottom 0.406: D1.C 36.19,52.23 IC1.1 36.55,51.25 C15.1 37.88,49.49 39.37,48.01 C17.+
N$30
  Bottom 0.305: R19.2 24.56,28.54 C2.2 25.93,27.37 IC6.12
N$32
  Bottom 0.305: R20.2 14.82,30.65 18.41,27.05 C10.1 20.74,28.64 R17.2 20.96,28.54 R19.1
N$37
  Bottom 0.305: R36.2 R34.2 44.13,12.13 43.96,12.3 Q901.1
N$39  (via drill 0.3)
  Top 0.305: v27.3,17.04 v27.3,20.38
  Bottom 0.305: R404.2 23.18,20.49 C6.2 24.87,20.38 v27.3,20.38 27.3,22.23 IC6.8 26.57,22.29 | C21.+ 30.11,17.04 | 30.11,17.04 v27.3,17.04 | R31.1 30.11,18.13 30.11,17.04
N$41
  Bottom 0.305: R404.1 R1.1 R35.2 C8.1
OUT_L  (via drill 0.3)
  Top 0.254: JOUT.3 33.19,9.96 v33.21,9.94
  Bottom 0.254: 36.01,11.46 R4.1
  Bottom 0.305: R38.2 R4.1 34.43,9.94 v33.21,9.94
OUT_R  (via drill 0.3)
  Top 0.305: v12.7,15.62 12.7,6.63 JOUT.2
  Bottom 0.305: R5.1 13.23,4.83 JOUT.2 | R14.2 13.44,16.36 v12.7,15.62
USB_D_VBUS
  Top 0.305: POWER.3 1.27,52.15 2.54,50.88 2.54,48.32 USB.4

### Text on the board
tPlace: 5v | Rebel Technology | MicroLab Rev02
bPlace: GND | 5V | VBUS | Rebel Technology | MicroLab Rev03 | 3v3 | gnd | 5v